# EAGLE design NoBattNVRAM (EAGLE 6.5.0)
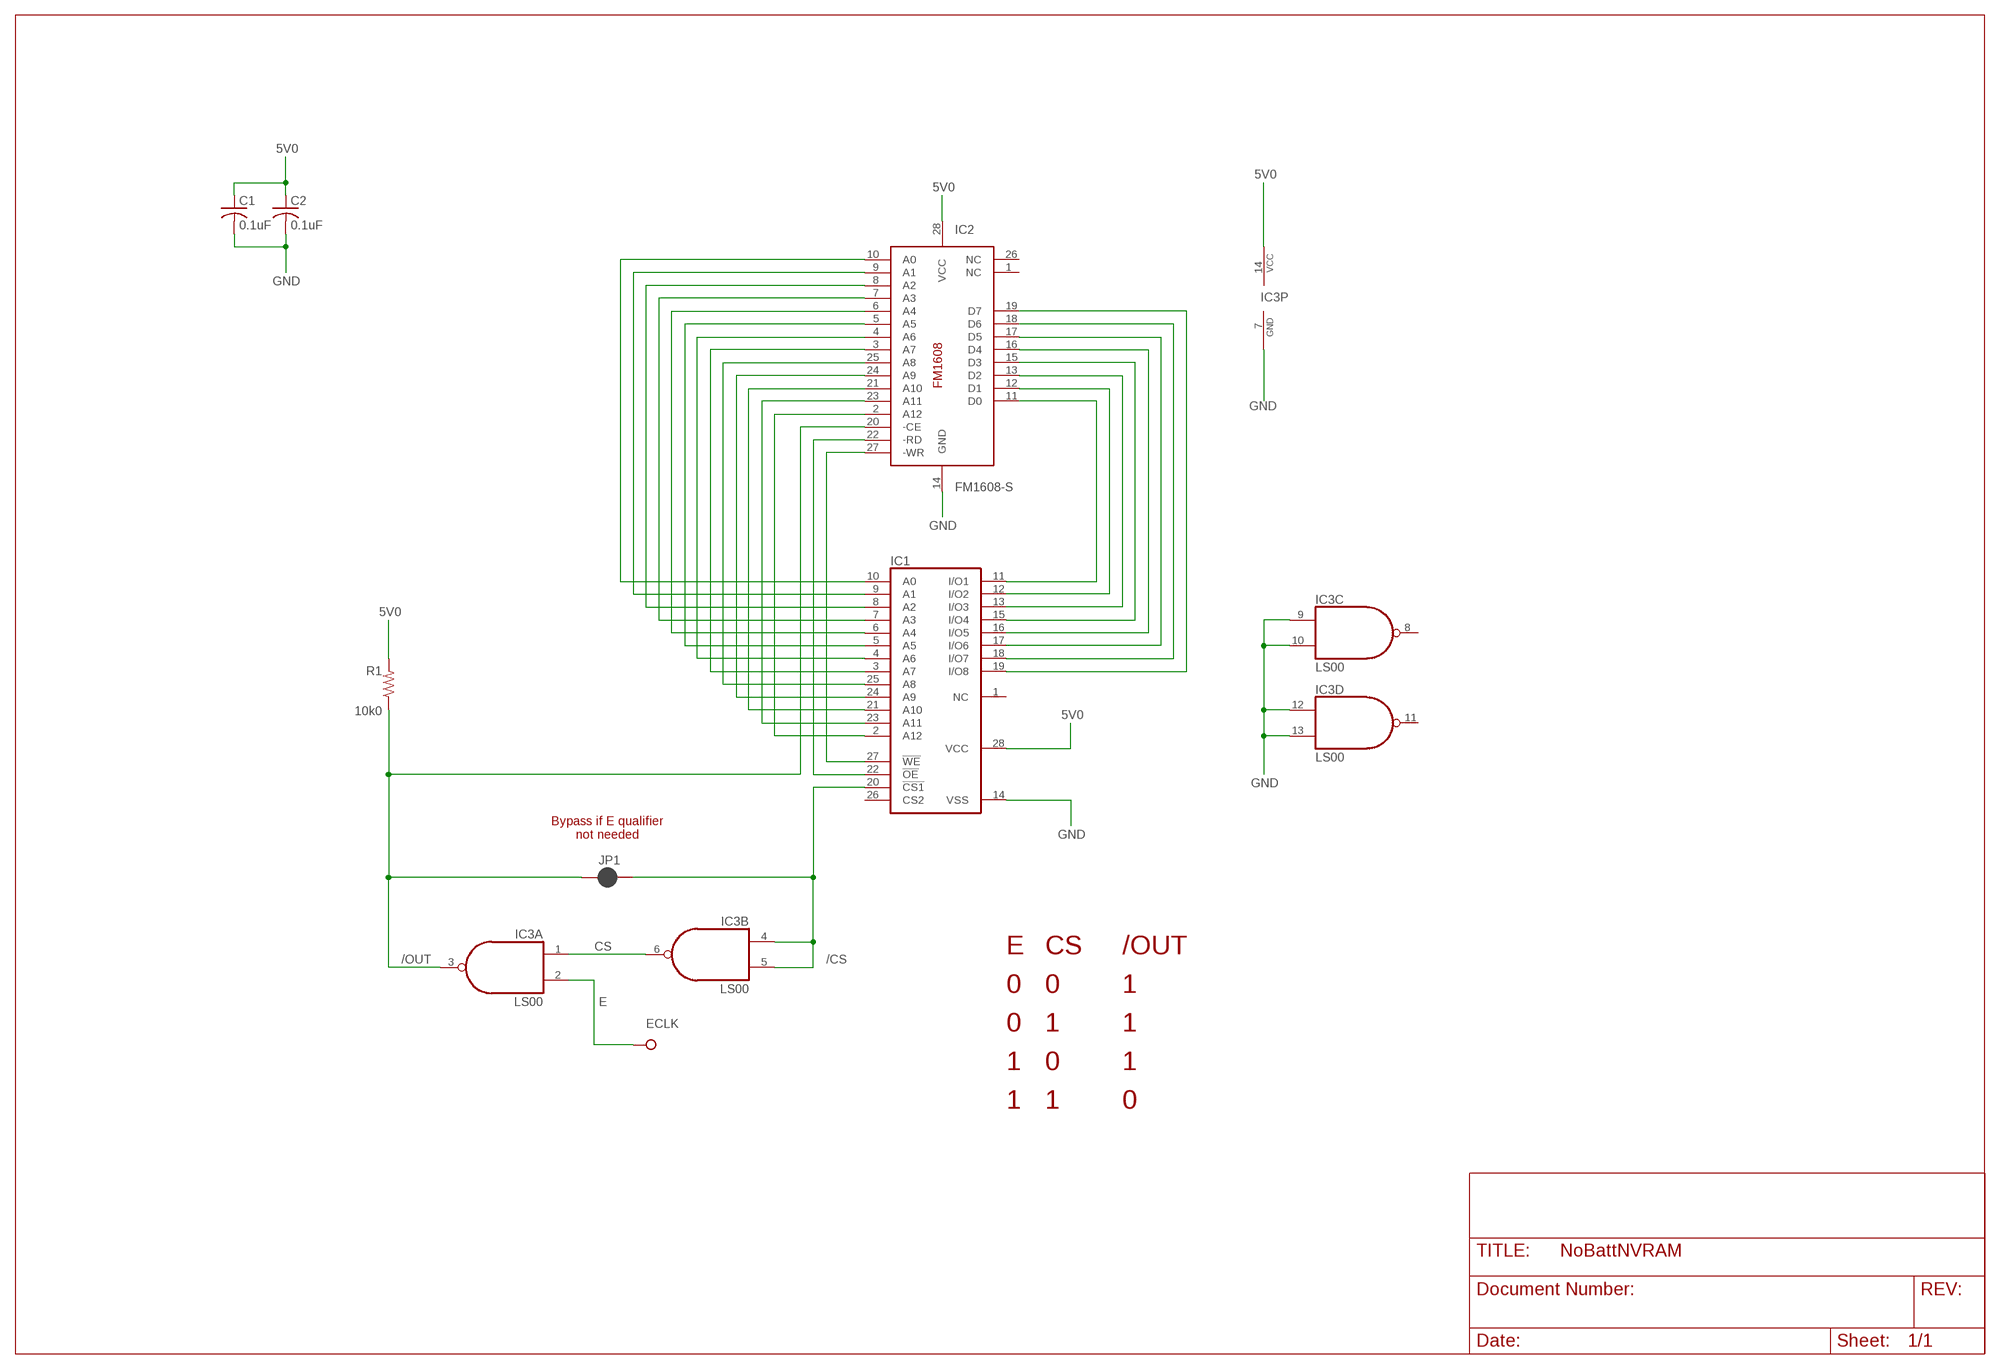
[diagram p0: schematic, sheet 1]

## Parts
C1  0.1uF  C-USC0603K  [C0603K]
C2  0.1uF  C-USC0603K  [C0603K]
ECLK  JOE-TP-SHORT  [JOE-TP-PKG]
IC1  6264A  [DIL28-6]
IC2  FM1608-S  [SO-28W]
IC3  LS00  74LS00D  [SO14]
JP1  JUMPER-PAD-2-NC_BY_PASTENO-SILK  [PAD-JUMPER-2-NC_BY_PASTE_NO_SILK]
R1  10k0  R-US_R0805  [R0805]

## Nets
5V0: C1.1 C2.1 IC1.28(VCC) IC2.28(VCC) IC3.14(P:VCC) R1.2
/CS: IC1.20(!CS1) IC3.4(B:I0) IC3.5(B:I1) JP1.1
/OUT: IC2.20(-CE) IC3.3(A:O) JP1.2 R1.1
CS: IC3.1(A:I0) IC3.6(B:O)
E: ECLK.PAD1 IC3.2(A:I1)
GND: C1.2 C2.2 IC1.14(VSS) IC2.14(GND) IC3.7(P:GND) IC3.9(C:I0) IC3.10(C:I1) IC3.12(D:I0) IC3.13(D:I1)
N$1: IC1.10(A0) IC2.10(A0)
N$2: IC1.9(A1) IC2.9(A1)
N$3: IC1.8(A2) IC2.8(A2)
N$4: IC1.7(A3) IC2.7(A3)
N$5: IC1.6(A4) IC2.6(A4)
N$6: IC1.5(A5) IC2.5(A5)
N$7: IC1.4(A6) IC2.4(A6)
N$8: IC1.3(A7) IC2.3(A7)
N$9: IC1.25(A8) IC2.25(A8)
N$10: IC1.24(A9) IC2.24(A9)
N$11: IC1.21(A10) IC2.21(A10)
N$12: IC1.23(A11) IC2.23(A11)
N$13: IC1.2(A12) IC2.2(A12)
N$14: IC1.27(!WE) IC2.27(-WR)
N$15: IC1.22(!OE) IC2.22(-RD)
N$17: IC1.19(I/O8) IC2.19(D7)
N$18: IC1.18(I/O7) IC2.18(D6)
N$19: IC1.17(I/O6) IC2.17(D5)
N$20: IC1.16(I/O5) IC2.16(D4)
N$21: IC1.15(I/O4) IC2.15(D3)
N$22: IC1.13(I/O3) IC2.13(D2)
N$23: IC1.12(I/O2) IC2.12(D1)
N$24: IC1.11(I/O1) IC2.11(D0)
Unconnected: IC1.1(NC) IC1.26(CS2) IC2.1(NC) IC2.26(NC) IC3.8(C:O) IC3.11(D:O)

## Notes on the sheet
- Bypass if E qualifier
  not needed
- E | CS | /OUT
- 0 | 0 | 1
- 0 | 1 | 1
- 1 | 0 | 1
- 1 | 1 | 0

## Library data of the parts
C1 C2 = rcl:C-US: CAPACITOR, American symbol
ECLK = joe-tp:JOE-TP-SHORT
IC1 = memory-hitachi:6264A: MEMORY; OC_FARNELL: 283605; OC_NEWARK: unknown
IC2 = ramtron-2:FM1608: FM1608 8k x 8 NVRAM 5V (Jedec) DIP/SO-28W
IC3 = 74xx-us:74*00: Quad 2-input NAND gate
JP1 = SparkFun-Passives:JUMPER-PAD-2-NC_BY_PASTE
R1 = rcl:R-US_: RESISTOR, American symbol

## Board
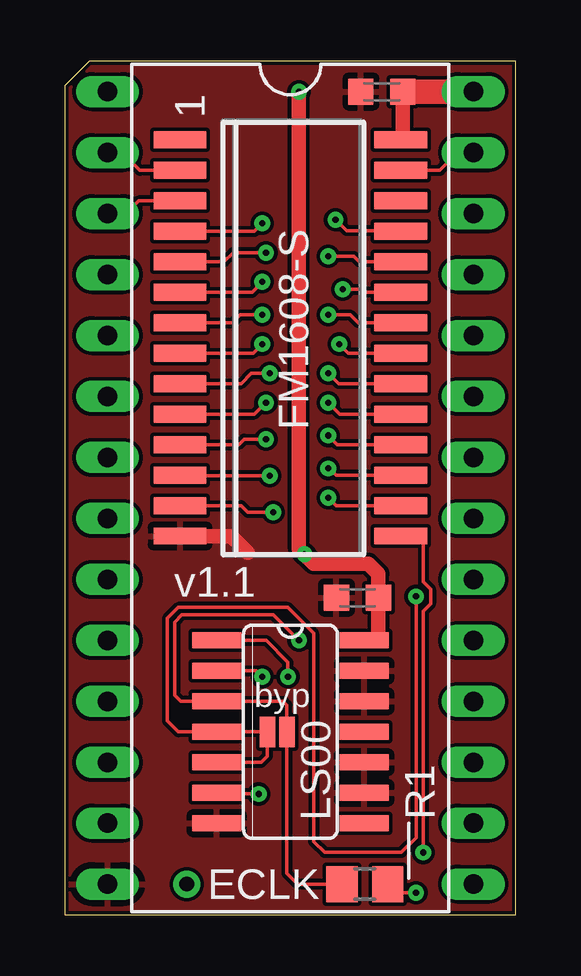
[diagram p1: board, top side]
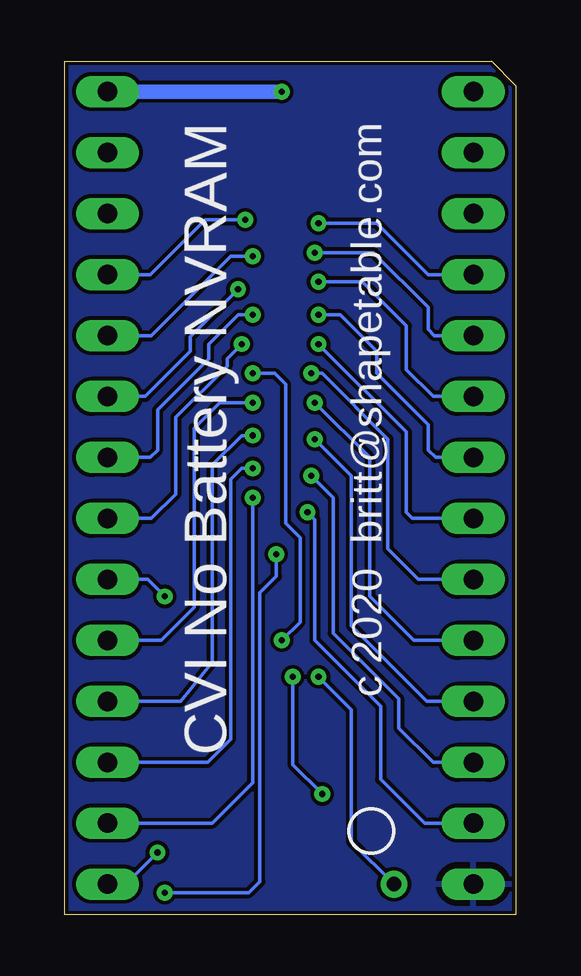
[diagram p2: board, bottom side, seen from below]

Size 18.8 x 35.56 mm. Coordinates in mm from the lower left corner, seen from the top.
Outline: 0,0 18.8,0 18.8,35.56 1.02,35.56 0,34.54 0,0
Copper layers (1*16): Top 0.035mm / dielectric 1.5mm / Bottom 0.035mm
Design rules "default *": minimum track width 6mil, minimum drill 10mil, track to track 6mil, track to pad 6mil, pad to pad 6mil, via to via 6mil, smd to smd 6mil, copper to edge 6mil, drill to drill 6mil, minimum pad ring 10mil, minimum via ring 8mil, stop-mask expansion 4mil, vias tented up to drill 10mil, thermal gap 10mil

### Footprints (pad centres in the part's own frame; a part is rotated, then mirrored left to right if it is on the bottom)
C0603K = smd 1.05 x 1.08: 1 -0.875,0; 2 0.875,0
JOE-TP-PKG = drill 0.61: PAD1 0,0
DIL28-6 = drill 0.813 long: 1 -16.51,-7.62; 2 -13.97,-7.62; 3 -11.43,-7.62; 4 -8.89,-7.62; 5 -6.35,-7.62; 6 -3.81,-7.62; 7 -1.27,-7.62; 8 1.27,-7.62; 9 3.81,-7.62; 10 6.35,-7.62; 11 8.89,-7.62; 12 11.43,-7.62; 13 13.97,-7.62; 14 16.51,-7.62; 15 16.51,7.62; 16 13.97,7.62; 17 11.43,7.62; 18 8.89,7.62; 19 6.35,7.62; 20 3.81,7.62; 21 1.27,7.62; 22 -1.27,7.62; 23 -3.81,7.62; 24 -6.35,7.62; 25 -8.89,7.62; 26 -11.43,7.62; 27 -13.97,7.62; 28 -16.51,7.62
SO-28W = smd 0.7 x 2.2: 1 -8.255,-4.6; 2 -6.985,-4.6; 3 -5.715,-4.6; 4 -4.445,-4.6; 5 -3.175,-4.6; 6 -1.905,-4.6; 7 -0.635,-4.6; 8 0.635,-4.6; 9 1.905,-4.6; 10 3.175,-4.6; 11 4.445,-4.6; 12 5.715,-4.6; 13 6.985,-4.6; 14 8.255,-4.6; 15 8.255,4.6; 16 6.985,4.6; 17 5.715,4.6; 18 4.445,4.6; 19 3.175,4.6; 20 1.905,4.6; 21 0.635,4.6; 22 -0.635,4.6; 23 -1.905,4.6; 24 -3.175,4.6; 25 -4.445,4.6; 26 -5.715,4.6; 27 -6.985,4.6; 28 -8.255,4.6
SO14 = smd 0.66 x 2.032: 1 -3.81,-3.073; 2 -2.54,-3.073; 3 -1.27,-3.073; 4 0,-3.073; 5 1.27,-3.073; 6 2.54,-3.073; 7 3.81,-3.073; 8 3.81,3.073; 9 2.54,3.073; 10 1.27,3.073; 11 0,3.073; 12 -1.27,3.073; 13 -2.54,3.073; 14 -3.81,3.073
PAD-JUMPER-2-NC_BY_PASTE_NO_SILK = smd 0.635 x 1.27: 1 -0.401,0; 2 0.413,0
R0805 = smd 1.3 x 1.5: 1 -0.95,0; 2 0.95,0

### Placement (x,y rotation side)
C1  13.21,34.29 180 top
C2  12.19,13.21 180 top
ECLK  5.08,1.27 0 top
IC1  9.4,17.78 270 top
IC2  9.4,24.03 270 top
IC3  9.4,7.62 270 top
JP1  8.84,7.62 0 top
R1  12.5,1.27 0 top

### Tracks (layer width: path | path; a pad name or v marks a point on that pad's centre or on a via)
5V0  (via drill 0.25)
  Top 0.152: R1.2 13.45,0.91 v14.63,0.91
  Top 0.61: IC2.28 14.08,32.28 C1.1 | IC3.14 13.07,11.43 C2.1 13.07,14.21 12.65,14.63 10.36,14.63 v9.98,15.01 9.75,15.24 v9.75,34.29
  Top 1.016: IC1.28 C1.1
  Bottom 0.152: v14.63,0.91 11.12,0.91 10.67,1.37 10.67,13.41 9.98,14.1 v9.98,15.01
  Bottom 0.61: v9.75,34.29 IC1.28
/CS  (via drill 0.25)
  Top 0.152: IC3.5 8.18,6.35 8.44,6.61 JP1.1 IC3.4 4.72,7.62 4.27,8.08 4.27,12.34 4.72,12.8 9.3,12.8 10.36,11.73 10.36,3.05 10.82,2.59 14.02,2.59 14.63,3.2 v14.63,13.26
  Bottom 0.152: IC1.20 15.34,13.97 v14.63,13.26
/OUT  (via drill 0.25)
  Top 0.152: v9.75,11.43 8.69,12.5 4.88,12.5 4.57,12.19 4.57,9.14 4.83,8.89 IC3.3 9.09,8.89 9.25,8.73 JP1.2 9.25,1.72 9.7,1.27 R1.1 | IC2.20 11.4,22.12 v10.97,22.55
  Bottom 0.152: v9.75,11.43 8.99,12.19 8.99,15.7 9.6,16.31 9.6,22.1 10.06,22.55 v10.97,22.55
CS  (via drill 0.25)
  Top 0.152: IC3.1 8.38,11.43 9.3,10.52 v9.3,9.91 | v8.08,5.03 6.38,5.03 IC3.6
  Bottom 0.152: v9.3,9.91 9.3,6.25 v8.08,5.03
E  (via drill 0.25)
  Top 0.152: IC3.2 7.98,10.16 v8.23,9.91
  Bottom 0.152: v8.23,9.91 6.86,8.53 6.86,3.05 ECLK.PAD1
GND
  Top 0.61: IC2.14 6.93,15.77 7.62,15.09
  pour Bottom (isolate 0.152): 0,0 0,35.56 18.8,35.56 18.8,0
  pour Top (isolate 0.152): 0,0 18.8,0 18.8,35.56 0,35.56
N$1  (via drill 0.25)
  Top 0.152: IC2.10 7.9,20.85 v8.38,21.34
  Bottom 0.152: v8.38,21.34 6.1,19.05 6.1,13.26 4.27,11.43 IC1.10
N$2  (via drill 0.25)
  Top 0.152: IC2.9 7.34,22.12 7.77,22.55 v8.53,22.55
  Bottom 0.152: IC1.9 4.06,13.97 5.33,15.24 5.33,19.81 8.08,22.55 v8.53,22.55
N$3  (via drill 0.25)
  Top 0.152: IC2.8 7.85,23.39 v8.23,23.77
  Bottom 0.152: v8.23,23.77 4.57,20.12 4.57,16.76 4.32,16.51 IC1.8
N$4  (via drill 0.25)
  Top 0.152: IC2.7 6.98,24.66 7.31,24.99 v8.23,24.99
  Bottom 0.152: IC1.7 3.35,19.05 3.66,19.36 3.66,20.42 5.79,22.55 5.79,23.47 7.31,24.99 v8.23,24.99
N$5  (via drill 0.25)
  Top 0.152: v8.23,26.36 7.8,25.93 IC2.6
  Bottom 0.152: IC1.6 3.45,21.59 4.57,22.71 4.57,24.54 6.4,26.36 v8.23,26.36
N$6  (via drill 0.25)
  Top 0.152: v8.38,27.58 7.01,27.58 6.63,27.2 IC2.5
  Bottom 0.152: IC1.5 3.4,24.13 3.66,24.38 3.66,25.3 5.94,27.58 v8.38,27.58
N$7  (via drill 0.25)
  Top 0.152: v8.23,28.8 7.9,28.47 IC2.4
  Bottom 0.152: IC1.4 3.66,26.67 5.79,28.8 v8.23,28.8
N$8
  Top 0.152: IC2.3 3.07,29.74 2.59,29.26 1.83,29.26 IC1.3
N$9  (via drill 0.25)
  Top 0.152: IC2.25 13.97,28.5 11.73,28.5 v11.28,28.96
  Bottom 0.152: IC1.25 15.24,26.67 12.95,28.96 v11.28,28.96
N$10  (via drill 0.25)
  Top 0.152: v10.97,27.43 12.04,27.43 12.27,27.2 IC2.24
  Bottom 0.152: IC1.24 15.19,24.13 11.89,27.43 v10.97,27.43
N$11  (via drill 0.25)
  Top 0.152: IC2.21 11.81,23.39 v11.43,23.77
  Bottom 0.152: IC1.21 15.19,16.51 14.17,17.53 14.17,20.73 12.04,22.86 12.04,23.16 v11.43,23.77
N$12  (via drill 0.25)
  Top 0.152: v11.58,26.06 12.34,26.06 12.47,25.93 IC2.23
  Bottom 0.152: IC1.23 15.44,21.59 13.56,23.47 13.56,24.08 v11.58,26.06
N$13
  Top 0.152: IC2.2 3.12,31.01 2.44,31.7 1.83,31.7 IC1.2
N$14
  Top 0.152: IC2.27 15.62,31.01 16.31,31.7 16.97,31.7 IC1.27
N$15  (via drill 0.25)
  Top 0.152: v10.97,24.99 11.89,24.99 12.22,24.66 IC2.22
  Bottom 0.152: IC1.22 15.24,19.05 14.93,19.36 14.93,21.03 12.8,23.16 12.8,23.77 11.58,24.99 v10.97,24.99
N$17  (via drill 0.25)
  Top 0.152: IC2.19 11.46,20.85 v10.97,21.34
  Bottom 0.152: v10.97,21.34 12.34,21.34 13.41,20.27 13.41,12.8 14.78,11.43 IC1.19
N$18  (via drill 0.25)
  Top 0.152: IC2.18 11.35,19.58 v10.97,19.96
  Bottom 0.152: IC1.18 13.97,8.89 12.65,10.52 12.65,18.75 11.43,19.96 v10.97,19.96
N$19  (via drill 0.25)
  Top 0.152: IC2.17 11.3,18.31 v10.97,18.59
  Bottom 0.152: IC1.17 12.85,6.35 11.89,7.32 11.89,18.14 11.43,18.59 v10.97,18.59
N$20  (via drill 0.25)
  Top 0.152: IC2.16 11.3,17.04 v10.97,17.37
  Bottom 0.152: IC1.16 12.65,3.81 10.97,5.49 v10.97,17.37
N$21  (via drill 0.25)
  Top 0.152: v14.93,2.59 14.93,12.65 15.24,12.95 15.24,13.56 14.93,13.87 14.93,15.7 14.07,15.7 IC2.15
  Bottom 0.152: v14.93,2.59 16.26,1.27 IC1.15
N$22  (via drill 0.25)
  Top 0.152: IC2.13 7.34,17.04 7.62,16.76 v8.69,16.76
  Bottom 0.152: v8.69,16.76 8.38,16.46 8.38,11.43 5.64,8.69 5.64,5.64 3.81,3.81 IC1.13
N$23  (via drill 0.25)
  Top 0.152: v8.53,18.29 4.82,18.29 IC2.12
  Bottom 0.152: v8.53,18.29 7.62,17.37 7.62,11.73 4.88,8.99 4.88,7.77 3.45,6.35 IC1.12
N$24  (via drill 0.25)
  Top 0.152: IC2.11 7.24,19.58 7.47,19.81 v8.38,19.81
  Bottom 0.152: v8.38,19.81 6.86,18.29 6.86,12.04 3.71,8.89 IC1.11

### Text on the board
tPlace: v1.1 | byp
bPlace: c 2020 britt@shapetable.com | CVI No Battery NVRAM